# Altium schematic sheet Server I2C & GND.schdoc
size 468 x 152 mm
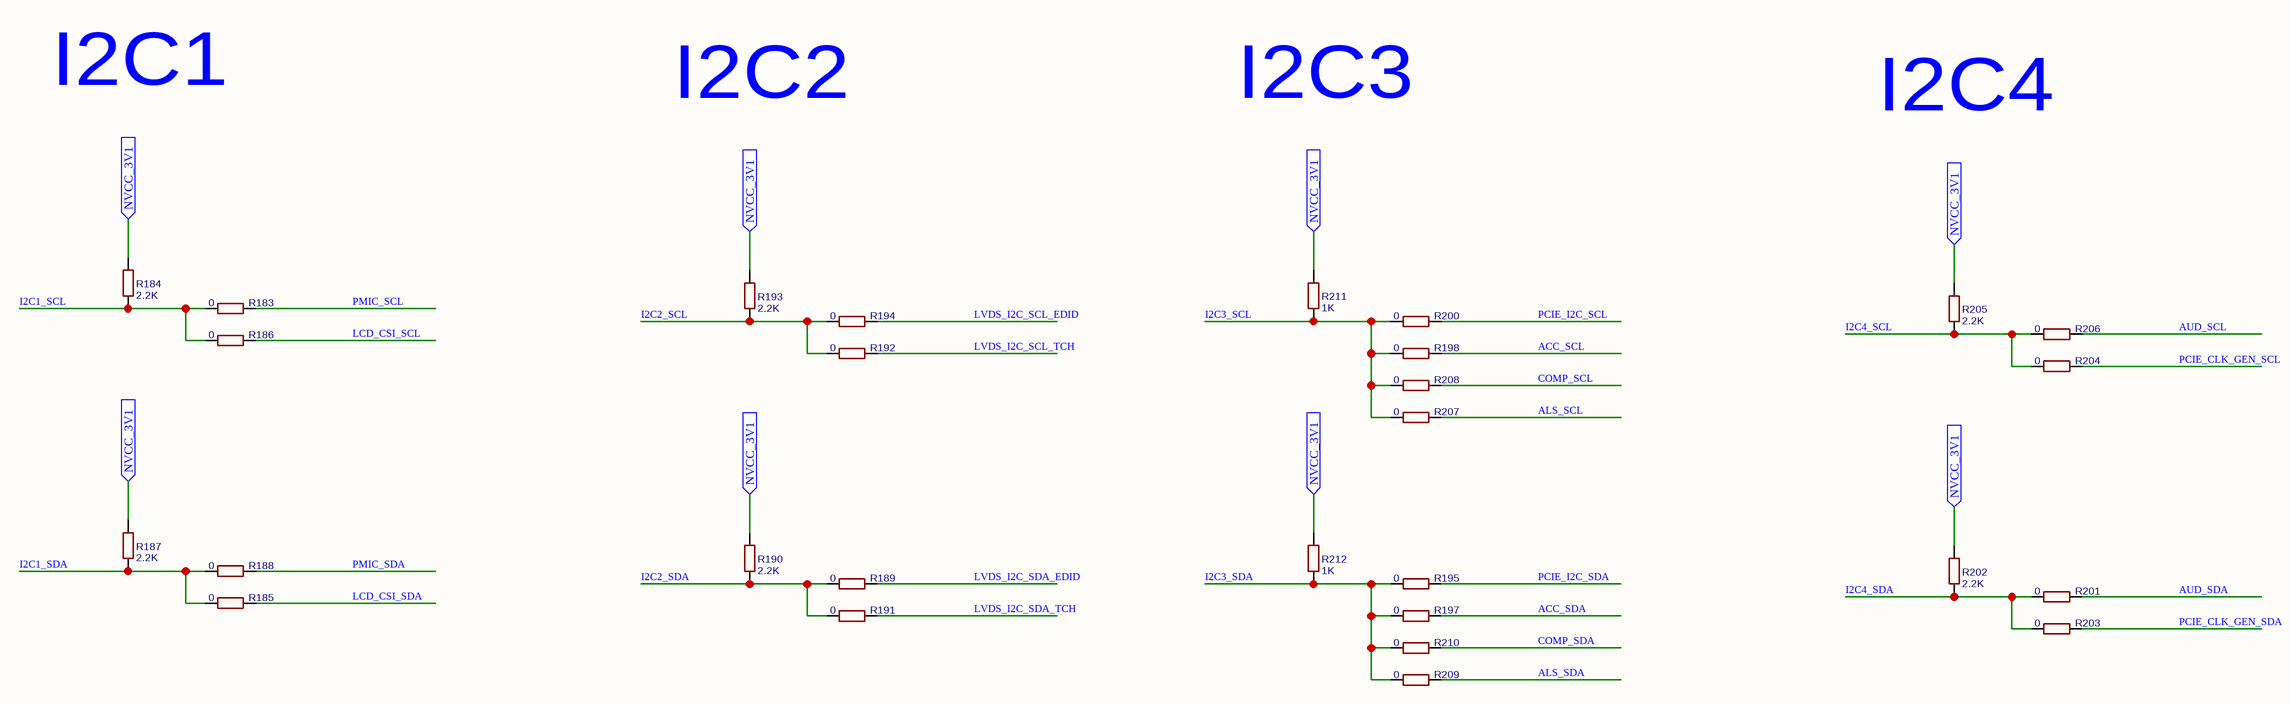
[diagram p0: Server I2C & GND.schdoc]

## Parts
R183  0  [R0402]
R184  2.2K  [R0402]
R185  0  [R0402]
R186  0  [R0402]
R187  2.2K  [R0402]
R188  0  [R0402]
R189  0  [R0402]
R190  2.2K  [R0402]
R191  0  [R0402]
R192  0  [R0402]
R193  2.2K  [R0402]
R194  0  [R0402]
R195  0  [R0402]
R197  0  [R0402]
R198  0  [R0402]
R200  0  [R0402]
R201  0  [R0402]
R202  2.2K  [R0402]
R203  0  [R0402]
R204  0  [R0402]
R205  2.2K  [R0402]
R206  0  [R0402]
R207  0  [R0402]
R208  0  [R0402]
R209  0  [R0402]
R210  0  [R0402]
R211  1K  [R0402]
R212  1K  [R0402]

## Ports
NVCC_3V1 (in)

## Nets
ACC_SCL: R198.2
ACC_SDA: R197.2
ALS_SCL: R207.2
ALS_SDA: R209.2
AUD_SCL: R206.2
AUD_SDA: R201.2
COMP_SCL: R208.2
COMP_SDA: R210.2
I2C1_SCL: R183.1 R184.1 R186.1
I2C1_SDA: R185.1 R187.1 R188.1
I2C2_SCL: R192.1 R193.1 R194.1
I2C2_SDA: R189.1 R190.1 R191.1
I2C3_SCL: R198.1 R200.1 R207.1 R208.1 R211.1
I2C3_SDA: R195.1 R197.1 R209.1 R210.1 R212.1
I2C4_SCL: R204.1 R205.1 R206.1
I2C4_SDA: R201.1 R202.1 R203.1
LCD_CSI_SCL: R186.2
LCD_CSI_SDA: R185.2
LVDS_I2C_SCL_EDID: R194.2
LVDS_I2C_SCL_TCH: R192.2
LVDS_I2C_SDA_EDID: R189.2
LVDS_I2C_SDA_TCH: R191.2
NVCC_3V1: R184.2 R187.2 R190.2 R193.2 R202.2 R205.2 R211.2 R212.2 ; port NVCC_3V1
PCIE_CLK_GEN_SCL: R204.2
PCIE_CLK_GEN_SDA: R203.2
PCIE_I2C_SCL: R200.2
PCIE_I2C_SDA: R195.2
PMIC_SCL: R183.2
PMIC_SDA: R188.2

## Notes on the sheet
- I2C1
- I2C2
- I2C3
- I2C4

## Library data of the parts
R183 R185 R186 R188 R189 R191 R192 R194 R195 R197 R198 R200 R201 R203 R204 R206-R210 = 0: BOM_Manufacturer: KOA; BOM_Manufacturer Part: RK73Z1ETTP; nameAlias: Resistance (Ohms); BOM_Supplier: LCSC; BOM_Supplier Part: C131359; spicePre: R; spiceSymbolName: RK73Z1ETTP
R184 R187 R190 R193 R202 R205 = 2.2K: BOM_Manufacturer: UniOhm; BOM_Manufacturer Part: 0402WGF2201TCE; nameAlias: Resistance (Ohms); SMT Type: Basic; BOM_Supplier: LCSC; BOM_LCSC Assembly: Yes; BOM_Supplier Part: C25879; spicePre: R; spiceSymbolName: 0402WGF2201TCE
R211 R212 = 1K: BOM_Manufacturer: UniOhm; BOM_Manufacturer Part: 0402WGF1001TCE; nameAlias: Resistance (Ohms); SMT Type: Basic; BOM_Supplier: LCSC; BOM_LCSC Assembly: Yes; BOM_Supplier Part: C11702; spicePre: R; spiceSymbolName: 0402WGF1001TCE